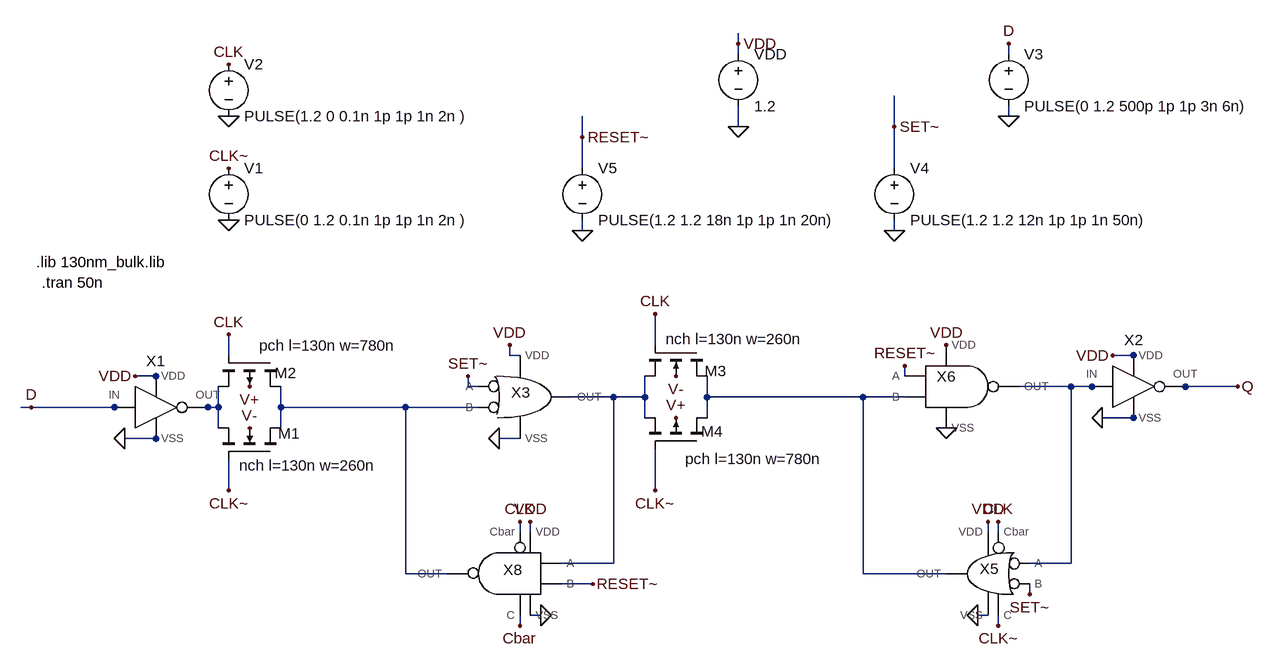
[diagram p0: schematic Prob4.asc]
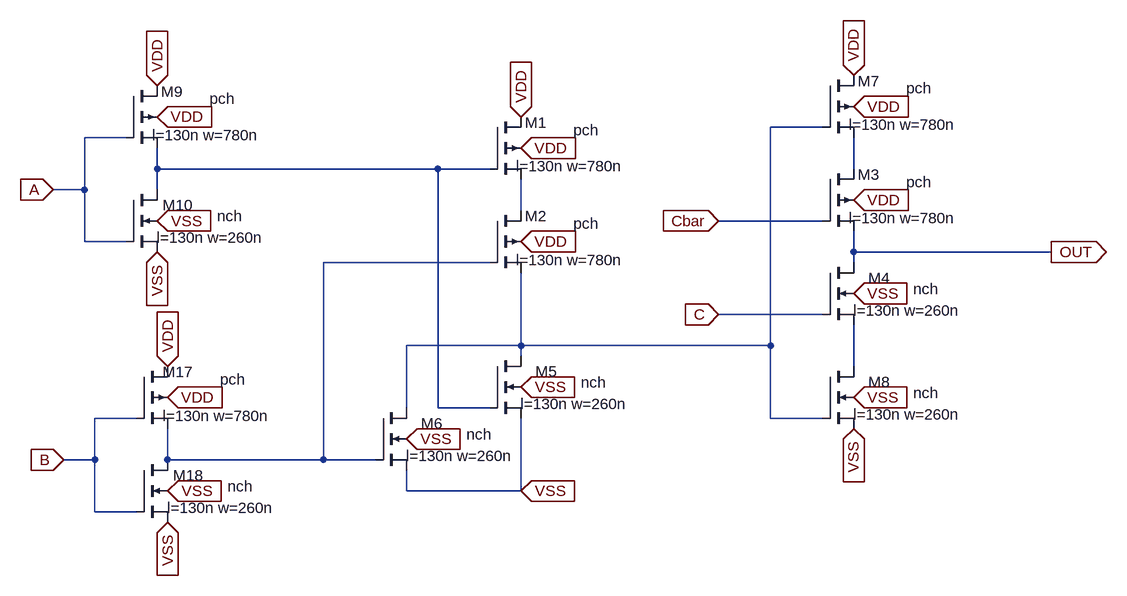
[diagram p1: sub-circuit or23state.asc]
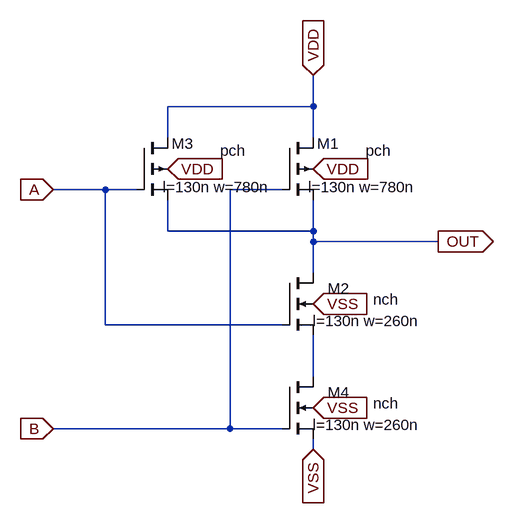
[diagram p2: sub-circuit nand2.asc]
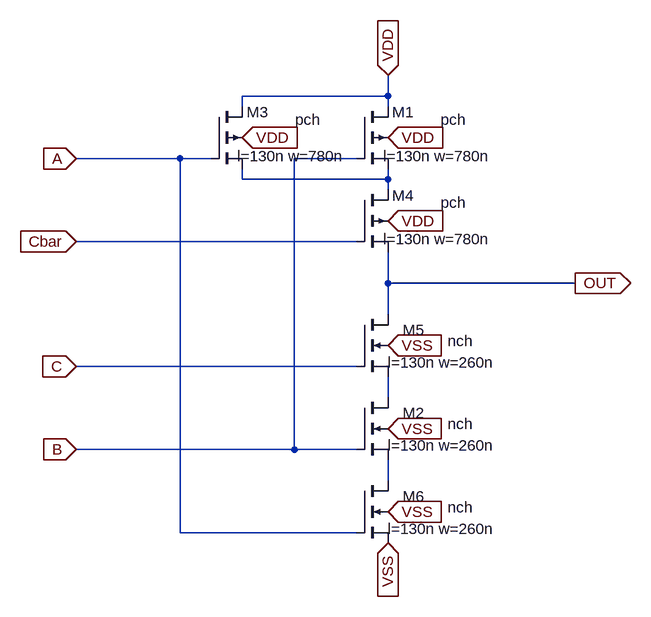
[diagram p3: sub-circuit nand23state.asc]
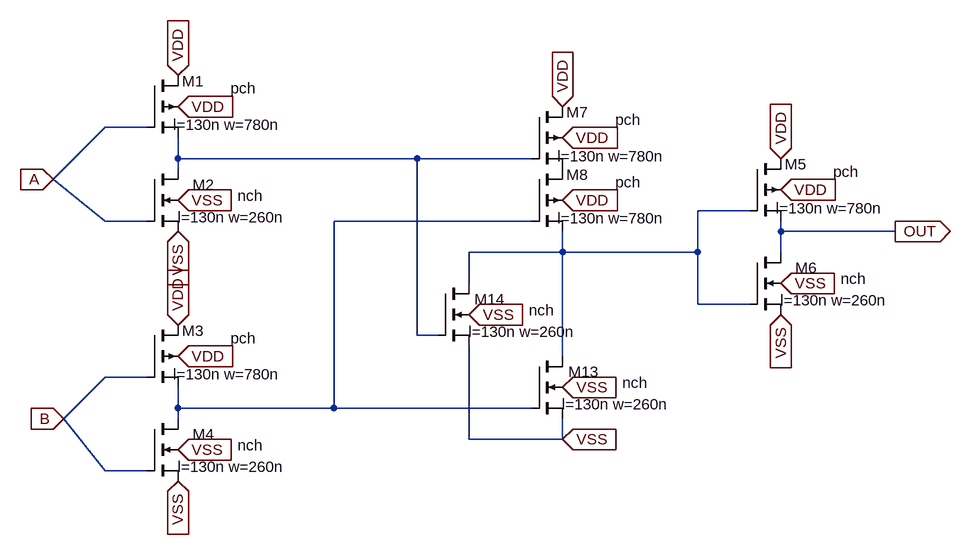
[diagram p4: sub-circuit or2.asc]
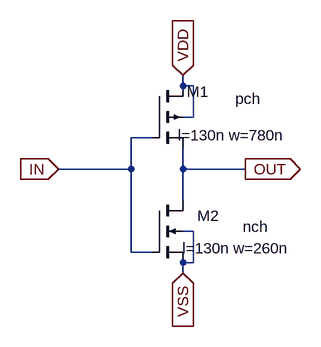
[diagram p5: sub-circuit inverter1.asc]
Prob4.asc, the LTspice schematic file:
Version 4.1
SHEET 1 4108 756
WIRE 2272 -960 2272 -976
WIRE 2272 -944 2272 -960
WIRE 2688 -944 2688 -960
WIRE 2688 -848 2688 -864
WIRE 2272 -832 2272 -864
WIRE 2512 -832 2512 -880
WIRE 2032 -816 2032 -848
WIRE 2032 -768 2032 -816
WIRE 2512 -768 2512 -832
WIRE 2032 -672 2032 -688
WIRE 2512 -672 2512 -688
WIRE 2144 -496 2144 -544
WIRE 1488 -480 1488 -512
WIRE 1920 -480 1920 -496
WIRE 1936 -480 1920 -480
WIRE 2880 -480 2848 -480
WIRE 2880 -464 2880 -480
WIRE 1376 -448 1344 -448
WIRE 2528 -448 2528 -464
WIRE 1376 -432 1376 -448
WIRE 1856 -432 1856 -448
WIRE 1872 -432 1856 -432
WIRE 2784 -432 2704 -432
WIRE 2816 -432 2784 -432
WIRE 2848 -432 2816 -432
WIRE 2960 -432 2928 -432
WIRE 3040 -432 2960 -432
WIRE 2080 -416 2016 -416
WIRE 2128 -416 2128 -448
WIRE 2128 -416 2080 -416
WIRE 2224 -416 2224 -448
WIRE 2464 -416 2224 -416
WIRE 2528 -416 2464 -416
WIRE 1184 -400 1168 -400
WIRE 1312 -400 1184 -400
WIRE 1344 -400 1312 -400
WIRE 1456 -400 1424 -400
WIRE 1472 -400 1472 -432
WIRE 1472 -400 1456 -400
WIRE 1568 -400 1568 -432
WIRE 1760 -400 1568 -400
WIRE 1872 -400 1760 -400
WIRE 2128 -384 2128 -416
WIRE 2224 -384 2224 -416
WIRE 2880 -384 2880 -400
WIRE 2880 -384 2832 -384
WIRE 1472 -368 1472 -400
WIRE 1568 -368 1568 -400
WIRE 1376 -352 1376 -368
WIRE 1376 -352 1328 -352
WIRE 1936 -352 1904 -352
WIRE 1488 -272 1488 -320
WIRE 2144 -272 2144 -336
WIRE 1936 -208 1936 -224
WIRE 1952 -208 1952 -224
WIRE 2656 -208 2656 -224
WIRE 2672 -208 2672 -224
WIRE 2080 -160 2080 -416
WIRE 2080 -160 2000 -160
WIRE 2784 -160 2784 -432
WIRE 2784 -160 2720 -160
WIRE 1760 -144 1760 -400
WIRE 1824 -144 1760 -144
WIRE 2464 -144 2464 -416
WIRE 2592 -144 2464 -144
WIRE 2048 -128 2000 -128
WIRE 2720 -112 2720 -128
WIRE 1968 -80 1952 -80
WIRE 2656 -80 2640 -80
WIRE 1936 -64 1936 -80
WIRE 2672 -64 2672 -80
FLAG 2272 -832 0
FLAG 2272 -960 VDD
FLAG 1344 -448 VDD
FLAG 1920 -496 VDD
FLAG 1952 -224 VDD
FLAG 2592 -496 VDD
FLAG 2656 -224 VDD
FLAG 2848 -480 VDD
FLAG 1328 -352 0
FLAG 1904 -352 0
FLAG 1968 -80 0
FLAG 2592 -368 0
FLAG 2640 -80 0
FLAG 2832 -384 0
FLAG 1488 -848 0
FLAG 1488 -688 0
FLAG 1488 -928 CLK
FLAG 1488 -768 CLK~
FLAG 1936 -224 CLK
FLAG 2672 -224 CLK
FLAG 1936 -64 Cbar
FLAG 2672 -64 CLK~
FLAG 2688 -848 0
FLAG 2688 -960 D
FLAG 1184 -400 D
FLAG 3040 -432 Q
FLAG 2512 -672 0
FLAG 2032 -672 0
FLAG 2512 -832 SET~
FLAG 1856 -448 SET~
FLAG 2720 -112 SET~
FLAG 2032 -816 RESET~
FLAG 2048 -128 RESET~
FLAG 2528 -464 RESET~
FLAG 1520 -432 V+
FLAG 1488 -272 CLK~
FLAG 1488 -512 CLK
FLAG 1520 -368 V-
FLAG 2176 -384 V+
FLAG 2144 -272 CLK~
FLAG 2144 -544 CLK
FLAG 2176 -448 V-
SYMBOL voltage 2272 -960 R0
WINDOW 123 0 0 Left 2
WINDOW 39 0 0 Left 2
SYMATTR InstName VDD
SYMATTR Value 1.2
SYMBOL Or23state 2672 -144 M0
SYMATTR InstName X5
SYMBOL Nand2 2592 -432 R0
SYMATTR InstName X6
SYMBOL Nand23state 1936 -144 M0
WINDOW 0 11 10 Bottom 2
SYMATTR InstName X8
SYMBOL voltage 1488 -784 R0
WINDOW 123 0 0 Left 0
WINDOW 39 0 0 Left 0
SYMATTR InstName V1
SYMATTR Value PULSE(0 1.2 0.1n 1p 1p 1n 2n )
SYMBOL voltage 1488 -944 R0
WINDOW 123 0 0 Left 0
WINDOW 39 0 0 Left 0
SYMATTR InstName V2
SYMATTR Value PULSE(1.2 0 0.1n 1p 1p 1n 2n )
SYMBOL voltage 2688 -960 R0
WINDOW 123 0 0 Left 0
WINDOW 39 0 0 Left 0
SYMATTR InstName V3
SYMATTR Value PULSE(0 1.2 500p 1p 1p 3n 6n)
SYMBOL voltage 2512 -784 R0
WINDOW 123 0 0 Left 0
WINDOW 39 0 0 Left 0
SYMATTR InstName V4
SYMATTR Value PULSE(1.2 1.2 12n 1p 1p 1n 50n)
SYMBOL voltage 2032 -784 R0
WINDOW 123 0 0 Left 0
WINDOW 39 0 0 Left 0
SYMATTR InstName V5
SYMATTR Value PULSE(1.2 1.2 18n 1p 1p 1n 20n)
SYMBOL Or2 1920 -416 R0
SYMATTR InstName X3
SYMBOL lib\\lib\\sym\\pmos4 1568 -480 R90
WINDOW 0 120 -30 VRight 2
WINDOW 3 -15 -178 VRight 2
SYMATTR InstName M1
SYMATTR Value pch l=130n w=780n
SYMBOL lib\\lib\\sym\\nmos4 1568 -320 M270
WINDOW 0 133 9 VLeft 2
WINDOW 3 -9 64 VLeft 2
SYMATTR InstName M2
SYMATTR Value nch l=130n w=260n
SYMBOL lib\\lib\\sym\\pmos4 2224 -336 M270
WINDOW 0 120 -30 VRight 2
WINDOW 3 -15 -178 VRight 2
SYMATTR InstName M3
SYMATTR Value pch l=130n w=780n
SYMBOL lib\\lib\\sym\\nmos4 2224 -496 R90
WINDOW 0 133 9 VLeft 2
WINDOW 3 -9 64 VLeft 2
SYMATTR InstName M4
SYMATTR Value nch l=130n w=260n
SYMBOL Inverter1 1376 -400 R0
SYMATTR InstName X1
SYMBOL Inverter1 2880 -432 R0
SYMATTR InstName X2
TEXT 1192 -624 Left 2 !.lib 130nm_bulk.lib
TEXT 1200 -592 Left 2 !.tran 50n

or23state.asc, the sub-circuit schematic file:
Version 4.1
SHEET 1 3404 1048
WIRE 2944 336 2864 336
WIRE 1872 352 1808 352
WIRE 1920 400 1920 368
WIRE 2352 400 1920 400
WIRE 2432 400 2352 400
WIRE 2992 400 2992 352
WIRE 1808 432 1808 352
WIRE 1808 432 1760 432
WIRE 1920 432 1920 400
WIRE 2480 464 2480 416
WIRE 2944 480 2784 480
WIRE 1808 512 1808 432
WIRE 1872 512 1808 512
WIRE 2992 528 2992 496
WIRE 3296 528 2992 528
WIRE 2432 544 2176 544
WIRE 2992 544 2992 528
WIRE 2944 624 2784 624
WIRE 2480 672 2480 560
WIRE 2480 672 2304 672
WIRE 2864 672 2864 336
WIRE 2864 672 2480 672
WIRE 2480 688 2480 672
WIRE 2992 704 2992 640
WIRE 2304 768 2304 672
WIRE 2352 768 2352 400
WIRE 2432 768 2352 768
WIRE 1888 784 1824 784
WIRE 2864 784 2864 672
WIRE 2944 784 2864 784
WIRE 1824 848 1824 784
WIRE 1824 848 1776 848
WIRE 1936 848 1936 800
WIRE 2176 848 2176 544
WIRE 2176 848 1936 848
WIRE 2256 848 2176 848
WIRE 2304 896 2304 864
WIRE 2480 896 2480 784
WIRE 2480 896 2304 896
WIRE 1824 928 1824 848
WIRE 1888 928 1824 928
FLAG 1920 272 VDD
IOPIN 1920 272 In
FLAG 1920 320 VDD
IOPIN 1920 320 In
FLAG 2480 320 VDD
IOPIN 2480 320 In
FLAG 2480 368 VDD
IOPIN 2480 368 In
FLAG 2480 512 VDD
IOPIN 2480 512 In
FLAG 2992 256 VDD
IOPIN 2992 256 In
FLAG 2992 304 VDD
IOPIN 2992 304 In
FLAG 2992 448 VDD
IOPIN 2992 448 In
FLAG 1936 704 VDD
IOPIN 1936 704 In
FLAG 1936 752 VDD
IOPIN 1936 752 In
FLAG 1920 480 VSS
IOPIN 1920 480 In
FLAG 1920 528 VSS
IOPIN 1920 528 In
FLAG 1936 896 VSS
IOPIN 1936 896 In
FLAG 1936 944 VSS
IOPIN 1936 944 In
FLAG 2480 736 VSS
IOPIN 2480 736 In
FLAG 2480 896 VSS
IOPIN 2480 896 In
FLAG 2992 752 VSS
IOPIN 2992 752 In
FLAG 2992 800 VSS
IOPIN 2992 800 In
FLAG 2992 592 VSS
IOPIN 2992 592 In
FLAG 2304 816 VSS
IOPIN 2304 816 In
FLAG 2784 480 Cbar
IOPIN 2784 480 In
FLAG 2784 624 C
IOPIN 2784 624 In
FLAG 1760 432 A
IOPIN 1760 432 In
FLAG 1776 848 B
IOPIN 1776 848 In
FLAG 3296 528 OUT
IOPIN 3296 528 Out
SYMBOL pmos4 2432 320 R0
WINDOW 0 88 9 Right 2
WINDOW 3 168 20 Right 2
WINDOW 123 206 76 Right 2
SYMATTR InstName M1
SYMATTR Value pch
SYMATTR Value2 l=130n w=780n
SYMBOL pmos4 2432 464 R0
WINDOW 0 88 9 Right 2
WINDOW 3 168 20 Right 2
WINDOW 123 206 76 Right 2
SYMATTR InstName M2
SYMATTR Value pch
SYMATTR Value2 l=130n w=780n
SYMBOL pmos4 2944 400 R0
WINDOW 0 88 9 Right 2
WINDOW 3 168 20 Right 2
WINDOW 123 206 76 Right 2
SYMATTR InstName M3
SYMATTR Value pch
SYMATTR Value2 l=130n w=780n
SYMBOL nmos4 2944 544 R0
WINDOW 0 104 24 Right 2
WINDOW 3 179 41 Right 2
WINDOW 123 213 74 Right 2
SYMATTR InstName M4
SYMATTR Value nch
SYMATTR Value2 l=130n w=260n
SYMBOL nmos4 2432 688 R0
WINDOW 0 104 24 Right 2
WINDOW 3 179 41 Right 2
WINDOW 123 213 74 Right 2
SYMATTR InstName M5
SYMATTR Value nch
SYMATTR Value2 l=130n w=260n
SYMBOL nmos4 2256 768 R0
WINDOW 0 104 24 Right 2
WINDOW 3 179 41 Right 2
WINDOW 123 213 74 Right 2
SYMATTR InstName M6
SYMATTR Value nch
SYMATTR Value2 l=130n w=260n
SYMBOL pmos4 2944 256 R0
WINDOW 0 88 9 Right 2
WINDOW 3 168 20 Right 2
WINDOW 123 206 76 Right 2
SYMATTR InstName M7
SYMATTR Value pch
SYMATTR Value2 l=130n w=780n
SYMBOL nmos4 2944 704 R0
WINDOW 0 104 24 Right 2
WINDOW 3 179 41 Right 2
WINDOW 123 213 74 Right 2
SYMATTR InstName M8
SYMATTR Value nch
SYMATTR Value2 l=130n w=260n
SYMBOL pmos4 1872 272 R0
WINDOW 0 88 9 Right 2
WINDOW 3 168 20 Right 2
WINDOW 123 206 76 Right 2
SYMATTR InstName M9
SYMATTR Value pch
SYMATTR Value2 l=130n w=780n
SYMBOL nmos4 1872 432 R0
WINDOW 0 104 24 Right 2
WINDOW 3 179 41 Right 2
WINDOW 123 213 74 Right 2
SYMATTR InstName M10
SYMATTR Value nch
SYMATTR Value2 l=130n w=260n
SYMBOL pmos4 1888 704 R0
WINDOW 0 88 9 Right 2
WINDOW 3 168 20 Right 2
WINDOW 123 206 76 Right 2
SYMATTR InstName M17
SYMATTR Value pch
SYMATTR Value2 l=130n w=780n
SYMBOL nmos4 1888 848 R0
WINDOW 0 104 24 Right 2
WINDOW 3 179 41 Right 2
WINDOW 123 213 74 Right 2
SYMATTR InstName M18
SYMATTR Value nch
SYMATTR Value2 l=130n w=260n

nand2.asc, the sub-circuit schematic file:
Version 4.1
SHEET 1 880 680
WIRE 128 -160 128 -208
WIRE 128 -160 -96 -160
WIRE -96 -112 -96 -160
WIRE 128 -112 128 -160
WIRE -192 -32 -272 -32
WIRE -144 -32 -192 -32
WIRE 80 -32 0 -32
WIRE -96 32 -96 -16
WIRE 128 32 128 -16
WIRE 128 32 -96 32
WIRE 128 48 128 32
WIRE 320 48 128 48
WIRE 128 96 128 48
WIRE -192 176 -192 -32
WIRE 80 176 -192 176
WIRE 128 256 128 192
WIRE 0 336 0 -32
WIRE 0 336 -272 336
WIRE 80 336 0 336
WIRE 128 368 128 352
FLAG -96 -64 VDD
IOPIN -96 -64 In
FLAG 128 -64 VDD
IOPIN 128 -64 In
FLAG 128 144 VSS
IOPIN 128 144 In
FLAG 128 304 VSS
IOPIN 128 304 In
FLAG 128 368 VSS
IOPIN 128 368 In
FLAG 128 -208 VDD
IOPIN 128 -208 In
FLAG -272 -32 A
IOPIN -272 -32 In
FLAG -272 336 B
IOPIN -272 336 In
FLAG 320 48 OUT
IOPIN 320 48 Out
SYMBOL pmos4 80 -112 R0
WINDOW 0 88 9 Right 2
WINDOW 3 168 20 Right 2
WINDOW 123 206 76 Right 2
SYMATTR InstName M1
SYMATTR Value pch
SYMATTR Value2 l=130n w=780n
SYMBOL nmos4 80 96 R0
WINDOW 0 104 24 Right 2
WINDOW 3 179 41 Right 2
WINDOW 123 213 74 Right 2
SYMATTR InstName M2
SYMATTR Value nch
SYMATTR Value2 l=130n w=260n
SYMBOL pmos4 -144 -112 R0
WINDOW 0 88 9 Right 2
WINDOW 3 168 20 Right 2
WINDOW 123 206 76 Right 2
SYMATTR InstName M3
SYMATTR Value pch
SYMATTR Value2 l=130n w=780n
SYMBOL nmos4 80 256 R0
WINDOW 0 104 24 Right 2
WINDOW 3 179 41 Right 2
WINDOW 123 213 74 Right 2
SYMATTR InstName M4
SYMATTR Value nch
SYMATTR Value2 l=130n w=260n

nand23state.asc, the sub-circuit schematic file:
Version 4.1
SHEET 1 880 792
WIRE 240 0 240 -32
WIRE 240 0 16 0
WIRE 16 16 16 0
WIRE 240 16 240 0
WIRE -80 96 -240 96
WIRE -32 96 -80 96
WIRE 192 96 96 96
WIRE 16 128 16 112
WIRE 240 128 240 112
WIRE 240 128 16 128
WIRE 240 144 240 128
WIRE 192 224 -240 224
WIRE 240 288 240 240
WIRE 528 288 240 288
WIRE 240 336 240 288
WIRE 192 416 -240 416
WIRE 240 464 240 432
WIRE 96 544 96 96
WIRE 96 544 -240 544
WIRE 192 544 96 544
WIRE 240 592 240 560
WIRE -80 672 -80 96
WIRE 192 672 -80 672
FLAG 240 688 VSS
IOPIN 240 688 In
FLAG 240 640 VSS
IOPIN 240 640 In
FLAG 240 512 VSS
IOPIN 240 512 In
FLAG 240 384 VSS
IOPIN 240 384 In
FLAG 240 -32 VDD
IOPIN 240 -32 In
FLAG 16 64 VDD
IOPIN 16 64 In
FLAG 240 64 VDD
IOPIN 240 64 In
FLAG 240 192 VDD
IOPIN 240 192 In
FLAG -240 416 C
IOPIN -240 416 In
FLAG -240 224 Cbar
IOPIN -240 224 In
FLAG -240 96 A
IOPIN -240 96 In
FLAG -240 544 B
IOPIN -240 544 In
FLAG 528 288 OUT
IOPIN 528 288 Out
SYMBOL pmos4 192 16 R0
WINDOW 0 88 9 Right 2
WINDOW 3 168 20 Right 2
WINDOW 123 206 76 Right 2
SYMATTR InstName M1
SYMATTR Value pch
SYMATTR Value2 l=130n w=780n
SYMBOL nmos4 192 464 R0
WINDOW 0 104 24 Right 2
WINDOW 3 179 41 Right 2
WINDOW 123 213 74 Right 2
SYMATTR InstName M2
SYMATTR Value nch
SYMATTR Value2 l=130n w=260n
SYMBOL pmos4 -32 16 R0
WINDOW 0 88 9 Right 2
WINDOW 3 168 20 Right 2
WINDOW 123 206 76 Right 2
SYMATTR InstName M3
SYMATTR Value pch
SYMATTR Value2 l=130n w=780n
SYMBOL pmos4 192 144 R0
WINDOW 0 88 9 Right 2
WINDOW 3 168 20 Right 2
WINDOW 123 206 76 Right 2
SYMATTR InstName M4
SYMATTR Value pch
SYMATTR Value2 l=130n w=780n
SYMBOL nmos4 192 336 R0
WINDOW 0 104 24 Right 2
WINDOW 3 179 41 Right 2
WINDOW 123 213 74 Right 2
SYMATTR InstName M5
SYMATTR Value nch
SYMATTR Value2 l=130n w=260n
SYMBOL nmos4 192 592 R0
WINDOW 0 104 24 Right 2
WINDOW 3 179 41 Right 2
WINDOW 123 213 74 Right 2
SYMATTR InstName M6
SYMATTR Value nch
SYMATTR Value2 l=130n w=260n

or2.asc, the sub-circuit schematic file:
Version 4.1
SHEET 1 2700 680
WIRE 1440 -256 1376 -256
WIRE 1488 -208 1488 -240
WIRE 1856 -208 1488 -208
WIRE 2032 -208 1856 -208
WIRE 1488 -192 1488 -208
WIRE 1296 -176 1376 -256
WIRE 2368 -128 2288 -128
WIRE 1376 -112 1296 -176
WIRE 1440 -112 1376 -112
WIRE 2032 -112 1728 -112
WIRE 2416 -96 2416 -112
WIRE 2592 -96 2416 -96
WIRE 2080 -64 2080 -96
WIRE 2080 -64 1936 -64
WIRE 2288 -64 2288 -128
WIRE 2288 -64 2080 -64
WIRE 2416 -64 2416 -96
WIRE 1936 -16 1936 -64
WIRE 2288 16 2288 -64
WIRE 2368 16 2288 16
WIRE 1856 64 1856 -208
WIRE 1888 64 1856 64
WIRE 2080 96 2080 -64
WIRE 1440 128 1376 128
WIRE 1488 176 1488 144
WIRE 1728 176 1728 -112
WIRE 1728 176 1488 176
WIRE 2032 176 1728 176
WIRE 1312 192 1376 128
WIRE 1488 192 1488 176
WIRE 1936 224 1936 80
WIRE 2080 224 2080 192
WIRE 2080 224 1936 224
WIRE 1376 272 1312 192
WIRE 1440 272 1376 272
FLAG 1488 -336 VDD
IOPIN 1488 -336 In
FLAG 1488 -288 VDD
IOPIN 1488 -288 In
FLAG 2080 -288 VDD
IOPIN 2080 -288 In
FLAG 2080 -240 VDD
IOPIN 2080 -240 In
FLAG 2080 -144 VDD
IOPIN 2080 -144 In
FLAG 2416 -208 VDD
IOPIN 2416 -208 In
FLAG 2416 -160 VDD
IOPIN 2416 -160 In
FLAG 1488 48 VDD
IOPIN 1488 48 In
FLAG 1488 96 VDD
IOPIN 1488 96 In
FLAG 1488 -144 VSS
IOPIN 1488 -144 In
FLAG 1488 -96 VSS
IOPIN 1488 -96 In
FLAG 1488 240 VSS
IOPIN 1488 240 In
FLAG 1488 288 VSS
IOPIN 1488 288 In
FLAG 2080 144 VSS
IOPIN 2080 144 In
FLAG 2080 224 VSS
IOPIN 2080 224 In
FLAG 2416 -16 VSS
IOPIN 2416 -16 In
FLAG 2416 32 VSS
IOPIN 2416 32 In
FLAG 1936 32 VSS
IOPIN 1936 32 In
FLAG 1296 -176 A
IOPIN 1296 -176 In
FLAG 1312 192 B
IOPIN 1312 192 In
FLAG 2592 -96 OUT
IOPIN 2592 -96 Out
SYMBOL pmos4 1440 -336 R0
WINDOW 0 88 9 Right 2
WINDOW 3 168 20 Right 2
WINDOW 123 206 76 Right 2
SYMATTR InstName M1
SYMATTR Value pch
SYMATTR Value2 l=130n w=780n
SYMBOL nmos4 1440 -192 R0
WINDOW 0 104 24 Right 2
WINDOW 3 179 41 Right 2
WINDOW 123 213 74 Right 2
SYMATTR InstName M2
SYMATTR Value nch
SYMATTR Value2 l=130n w=260n
SYMBOL pmos4 1440 48 R0
WINDOW 0 88 9 Right 2
WINDOW 3 168 20 Right 2
WINDOW 123 206 76 Right 2
SYMATTR InstName M3
SYMATTR Value pch
SYMATTR Value2 l=130n w=780n
SYMBOL nmos4 1440 192 R0
WINDOW 0 104 24 Right 2
WINDOW 3 179 41 Right 2
WINDOW 123 213 74 Right 2
SYMATTR InstName M4
SYMATTR Value nch
SYMATTR Value2 l=130n w=260n
SYMBOL pmos4 2368 -208 R0
WINDOW 0 88 9 Right 2
WINDOW 3 168 20 Right 2
WINDOW 123 206 76 Right 2
SYMATTR InstName M5
SYMATTR Value pch
SYMATTR Value2 l=130n w=780n
SYMBOL nmos4 2368 -64 R0
WINDOW 0 104 24 Right 2
WINDOW 3 179 41 Right 2
WINDOW 123 213 74 Right 2
SYMATTR InstName M6
SYMATTR Value nch
SYMATTR Value2 l=130n w=260n
SYMBOL pmos4 2032 -288 R0
WINDOW 0 88 9 Right 2
WINDOW 3 168 20 Right 2
WINDOW 123 206 76 Right 2
SYMATTR InstName M7
SYMATTR Value pch
SYMATTR Value2 l=130n w=780n
SYMBOL pmos4 2032 -192 R0
WINDOW 0 88 9 Right 2
WINDOW 3 168 20 Right 2
WINDOW 123 206 76 Right 2
SYMATTR InstName M8
SYMATTR Value pch
SYMATTR Value2 l=130n w=780n
SYMBOL nmos4 2032 96 R0
WINDOW 0 104 24 Right 2
WINDOW 3 179 41 Right 2
WINDOW 123 213 74 Right 2
SYMATTR InstName M13
SYMATTR Value nch
SYMATTR Value2 l=130n w=260n
SYMBOL nmos4 1888 -16 R0
WINDOW 0 104 24 Right 2
WINDOW 3 179 41 Right 2
WINDOW 123 213 74 Right 2
SYMATTR InstName M14
SYMATTR Value nch
SYMATTR Value2 l=130n w=260n

inverter1.asc, the sub-circuit schematic file:
Version 4.1
SHEET 1 880 680
WIRE 176 32 176 16
WIRE 192 32 176 32
WIRE 192 80 192 32
WIRE 192 80 176 80
WIRE 128 112 96 112
WIRE 96 160 96 112
WIRE 96 160 -16 160
WIRE 176 160 176 128
WIRE 272 160 176 160
WIRE 176 208 176 160
WIRE 192 256 176 256
WIRE 96 288 96 160
WIRE 128 288 96 288
WIRE 192 304 192 256
WIRE 192 304 176 304
WIRE 176 320 176 304
FLAG -16 160 IN
IOPIN -16 160 In
FLAG 176 16 VDD
IOPIN 176 16 In
FLAG 176 320 VSS
IOPIN 176 320 In
FLAG 272 160 OUT
IOPIN 272 160 Out
SYMBOL pmos4 128 32 R0
WINDOW 0 88 9 Right 2
WINDOW 3 168 20 Right 2
WINDOW 123 206 76 Right 2
SYMATTR InstName M1
SYMATTR Value pch
SYMATTR Value2 l=130n w=780n
SYMBOL nmos4 128 208 R0
WINDOW 0 104 24 Right 2
WINDOW 3 179 41 Right 2
WINDOW 123 213 74 Right 2
SYMATTR InstName M2
SYMATTR Value nch
SYMATTR Value2 l=130n w=260n

The netlist it stands for:
* Prob4.asc
VDD VDD 0 1.2
X§X5 N001 SET~ CLK~ CLK VDD 0 N003 or23state
X§X6 RESET~ N003 VDD 0 N001 nand2
X§X8 N002 RESET~ Cbar CLK VDD 0 N005 nand23state
V1 CLK~ 0 PULSE(0 1.2 0.1n 1p 1p 1n 2n )
V2 CLK 0 PULSE(1.2 0 0.1n 1p 1p 1n 2n )
V3 D 0 PULSE(0 1.2 500p 1p 1p 3n 6n)
V4 SET~ 0 PULSE(1.2 1.2 12n 1p 1p 1n 50n)
V5 RESET~ 0 PULSE(1.2 1.2 18n 1p 1p 1n 20n)
X§X3 SET~ N005 VDD 0 N002 or2
M1 N005 CLK N004 V+ pch l=130n w=780n
M2 N005 CLK~ N004 V- nch l=130n w=260n
M3 N003 CLK~ N002 V+ pch l=130n w=780n
M4 N003 CLK N002 V- nch l=130n w=260n
X§X1 D VDD 0 N004 inverter1
X§X2 N001 VDD 0 Q inverter1

* block symbol definitions
.subckt or23state A B C Cbar VDD VSS OUT
M1 VDD N002 N004 VDD pch l=130n w=780n
M2 N004 N005 N001 VDD pch l=130n w=780n
M3 N003 Cbar OUT VDD pch l=130n w=780n
M4 OUT C N006 VSS nch l=130n w=260n
M5 N001 N002 VSS VSS nch l=130n w=260n
M6 N001 N005 VSS VSS nch l=130n w=260n
M7 VDD N001 N003 VDD pch l=130n w=780n
M8 N006 N001 VSS VSS nch l=130n w=260n
M9 VDD A N002 VDD pch l=130n w=780n
M10 N002 A VSS VSS nch l=130n w=260n
M17 VDD B N005 VDD pch l=130n w=780n
M18 N005 B VSS VSS nch l=130n w=260n
.ends or23state

.subckt nand2 A B VDD VSS OUT
M1 VDD B OUT VDD pch l=130n w=780n
M2 OUT A N001 VSS nch l=130n w=260n
M3 VDD A OUT VDD pch l=130n w=780n
M4 N001 B VSS VSS nch l=130n w=260n
.ends nand2

.subckt nand23state A B C Cbar VDD VSS OUT
M1 VDD B N001 VDD pch l=130n w=780n
M2 N002 B N003 VSS nch l=130n w=260n
M3 VDD A N001 VDD pch l=130n w=780n
M4 N001 Cbar OUT VDD pch l=130n w=780n
M5 OUT C N002 VSS nch l=130n w=260n
M6 N003 A VSS VSS nch l=130n w=260n
.ends nand23state

.subckt or2 A B VDD VSS OUT
M1 VDD A N001 VDD pch l=130n w=780n
M2 N001 A VSS VSS nch l=130n w=260n
M3 VDD B N003 VDD pch l=130n w=780n
M4 N003 B VSS VSS nch l=130n w=260n
M5 VDD N002 OUT VDD pch l=130n w=780n
M6 OUT N002 VSS VSS nch l=130n w=260n
M7 VDD N001 P001 VDD pch l=130n w=780n
M8 P001 N003 N002 VDD pch l=130n w=780n
M13 N002 N003 VSS VSS nch l=130n w=260n
M14 N002 N001 VSS VSS nch l=130n w=260n
.ends or2

.subckt inverter1 IN VDD VSS OUT
M1 VDD IN OUT VDD pch l=130n w=780n
M2 OUT IN VSS VSS nch l=130n w=260n
.ends inverter1

.model NMOS NMOS
.model PMOS PMOS
.lib standard.mos
.lib 130nm_bulk.lib
.tran 50n
.backanno
.end